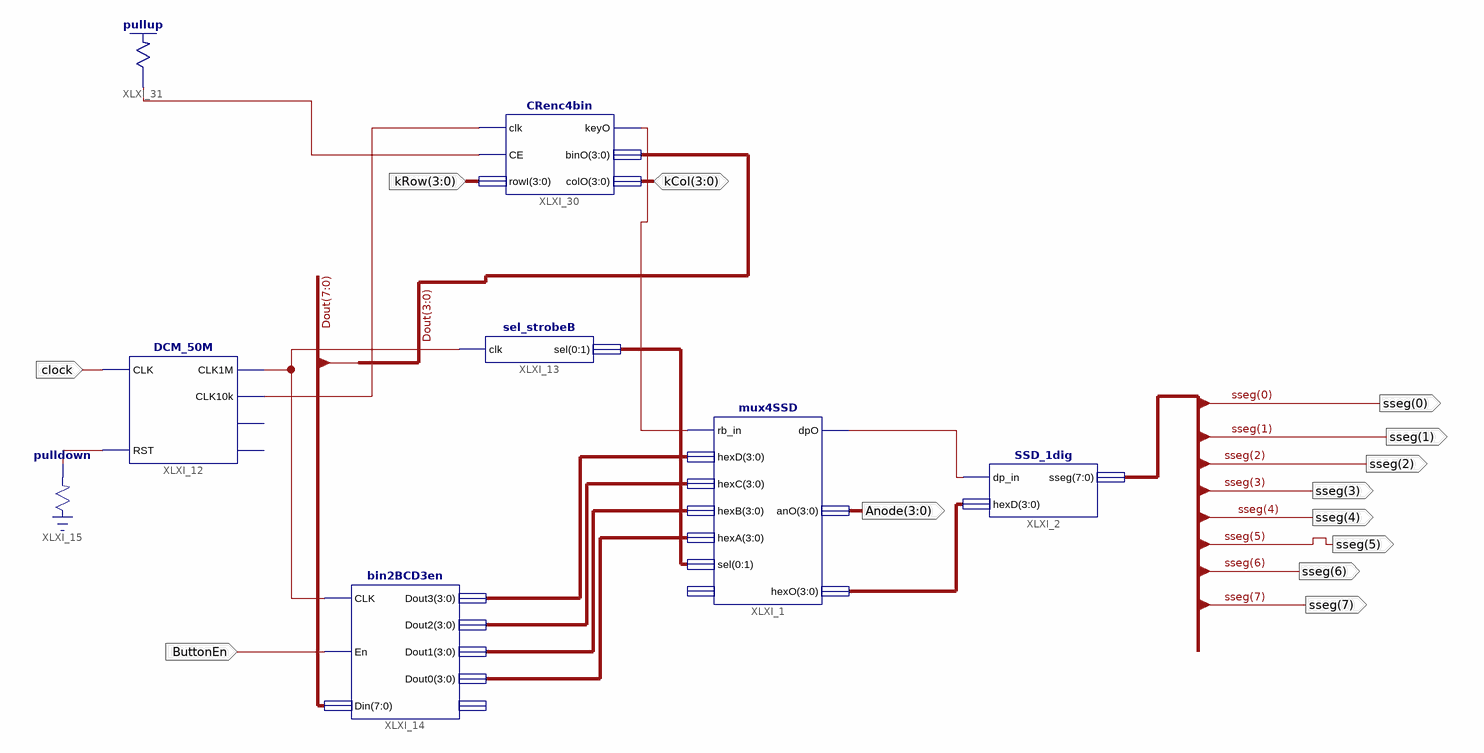
[diagram p0: schematic sheet 1]
// Xilinx ISE schematic exp4.sch (spartan3e) as structural Verilog: 8 symbols, 13 ports
module exp4 (
  input  clock,
  input  ButtonEn,
  input  [3:0] kRow,
  inout  [3:0] kCol,
  output [7:0] sseg,
  output [3:0] Anode
);

  wire XLXN_8, XLXN_33, XLXN_114, XLXN_118, XLXN_123, XLXN_125;
  wire [1:0] XLXN_41;
  wire [3:0] XLXN_7, XLXN_37, XLXN_38, XLXN_39, XLXN_40;
  wire [7:0] Dout;

  SSD_1dig XLXI_2 (.dp_in(XLXN_8), .hexD(XLXN_7), .sseg(sseg));
  mux4SSD XLXI_1 (
    .rb_in(XLXN_114), .hexD(XLXN_37), .hexC(XLXN_38), .hexB(XLXN_39), .hexA(XLXN_40),
    .sel({XLXN_41[0], XLXN_41[1]}), .dpO(XLXN_8), .anO(Anode), .hexO(XLXN_7));  // open: dp_in
  DCM_50M XLXI_12 (.CLK(clock), .RST(XLXN_33), .CLK1M(XLXN_125), .CLK10k(XLXN_123));  // open: CLK1k, CLK1
  bin2BCD3en XLXI_14 (
    .CLK(XLXN_125), .En(ButtonEn), .Din(Dout), .Dout3(XLXN_37), .Dout2(XLXN_38), .Dout1(XLXN_39),
    .Dout0(XLXN_40));  // open: RBout
  \pulldown  XLXI_15 (.O(XLXN_33));
  sel_strobeB XLXI_13 (.clk(XLXN_125), .sel({XLXN_41[0], XLXN_41[1]}));
  CRenc4bin XLXI_30 (.clk(XLXN_123), .CE(XLXN_118), .rowI(kRow), .keyO(XLXN_114), .binO(Dout[3:0]), .colO(kCol));
  \pullup  XLXI_31 (.O(XLXN_118));
endmodule
